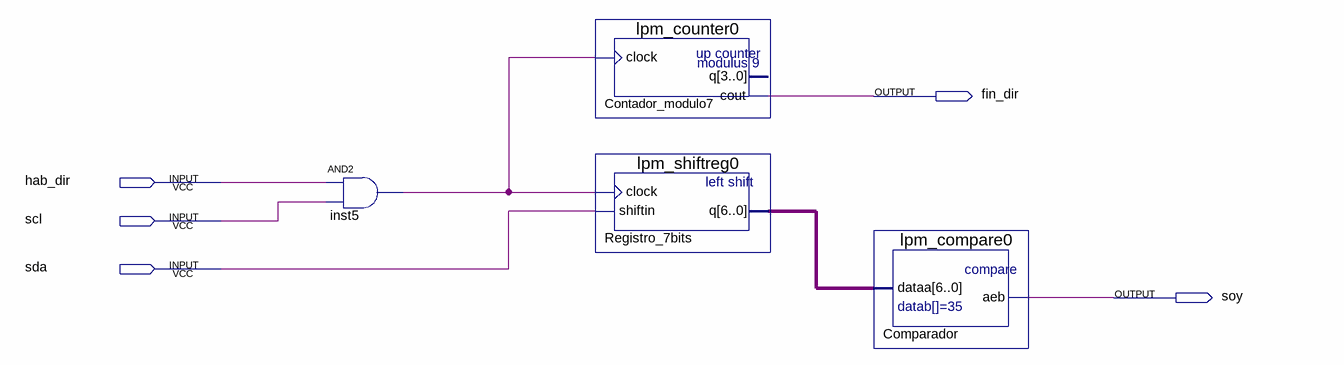
[diagram p0: schematic sheet]
// Quartus schematic Primer_bloque.bdf as structural Verilog: 4 symbols, 5 pins
module Primer_bloque (
  input  hab_dir,
  input  scl,
  input  sda,
  output fin_dir,
  output soy
);

  wire inst5_out;
  wire [6:0] Registro_7bits_q;

  and inst5 (inst5_out, hab_dir, scl);
  lpm_counter0 Contador_modulo7 (.clock(inst5_out), .cout(fin_dir));  // open: q
  lpm_shiftreg0 Registro_7bits (.clock(inst5_out), .shiftin(sda), .q(Registro_7bits_q));
  lpm_compare0 Comparador (.dataa(Registro_7bits_q), .aeb(soy));
endmodule
